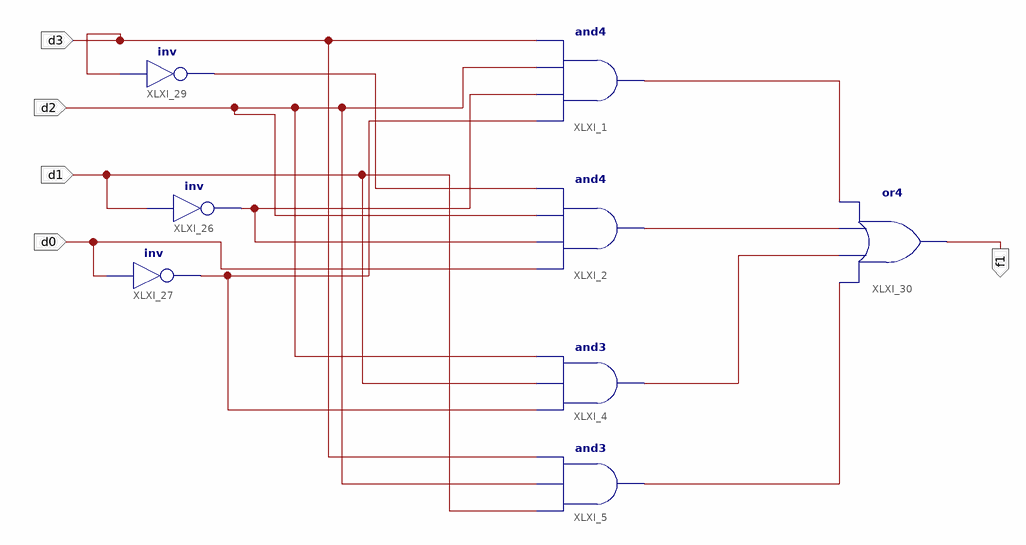
[diagram p0: schematic sheet 1]
// Xilinx ISE schematic B.sch (spartan3e) as structural Verilog: 8 symbols, 5 ports
module B (
  input  d3,
  input  d1,
  input  d0,
  input  d2,
  output f1
);

  wire XLXN_13, XLXN_14, XLXN_17, XLXN_20, XLXN_21, XLXN_22, XLXN_24;

  and XLXI_1 (XLXN_20, XLXN_17, XLXN_14, d2, d3);
  and XLXI_2 (XLXN_21, d0, XLXN_14, d2, XLXN_13);
  and XLXI_4 (XLXN_22, XLXN_17, d1, d2);
  and XLXI_5 (XLXN_24, d1, d2, d3);
  not XLXI_26 (XLXN_14, d1);
  not XLXI_27 (XLXN_17, d0);
  not XLXI_29 (XLXN_13, d3);
  or XLXI_30 (f1, XLXN_24, XLXN_22, XLXN_21, XLXN_20);
endmodule
